# Altium schematic sheet 5V-3.3V Buck Converter.SchDoc: 5V - 3.3V Buck Converter
size Letter; DrawnBy: Cindy Li; Organization: Altium Limited; Address1: L3, 12a Rodborough Rd; Address2: Frenchs Forest; Address3: NSW; Address4: Australia 2086; DocumentNumber: 1; SheetNumber: 1; SheetTotal: 1
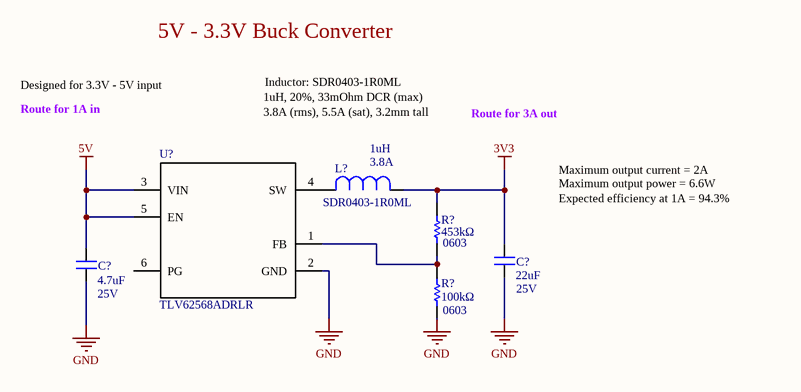
[diagram p0: 5V-3.3V Buck Converter.SchDoc]

## Parts
(Parts that share a designator on the sheet are numbered #1, #2 ... from top to bottom, then left to right.)
C?#1  value 4.7uF  Voltage Rating: 25V  [CAPC3225X280N]  (hidden comment: CAP_4.7uF_25V_1210)
C?#2  Voltage: 25V  Capacitance: 22uF  [CAPC3225X270N]  (hidden comment: GRM32ER71E226ME15K)
L?  value 1uH  Manufacturer Part Number 1: SDR0403-1R0ML  Current Rating: 3.8A  [IND_BOURNS_SDR04]  (hidden comment: IND_1uH_3.8A)
R?#1  value 453kΩ  Package: 0603  [RESC0603(1608)_N]  (hidden comment: RES_453kΩ_0603)
R?#2  value 100kΩ  Package: 0603  [RESC0603(1608)_N]  (hidden comment: RES_100kΩ_0603_1%)
U?  TLV62568ADRLR  [SOT50P160X60-6N]

## Nets
3V3: C?#2.2 L?.2 R?#1.2
5V: C?#1.2 U?.3(VIN) U?.5(EN)
GND: C?#1.1 C?#2.1 R?#2.1 U?.2(GND)
NetL?_1: L?.1 U?.4(SW)
NetR?#1_1: R?#1.1 R?#2.2 U?.1(FB)

Not connected (* = marked no-connect by the designer): U? 6(PG)

## Notes on the sheet
- Designed for 3.3V - 5V input
- 5V - 3.3V Buck Converter
- Inductor: SDR0403-1R0ML
- Route for 1A in
- 1uH, 20%, 33mOhm DCR (max)
- 3.8A (rms), 5.5A (sat), 3.2mm tall
- Route for 3A out
- Maximum output current = 2A
- Maximum output power = 6.6W
- Expected efficiency at 1A = 94.3%
- Title
- Size:
- Date:
- Letter
- Drawn By:
- Sheet
- of
- File:

## Library data of the parts
C?#1 = CAP_4.7uF_25V_1210: CAP CER 4.7UF 25V X8L 1210; Manufacturer Part Number 1: GCJ32EL81E475KA01L; Manufacturer 1: Murata Electronics; Tolerance: 10%; Supplier Part Number 1: 490-16465-1-ND; Supplier 1: Digi-Key; Mount: Surface Mount; Case/Package: 1210; Case Code (Metric): 3225; Case Code (Imperial): 1210; Min Operating Temperature: -55°C; Max Operating Temperature: 150°C; Capacitance: 4.7uF
C?#2 = GRM32ER71E226ME15K: CAP CER 22UF 25V X7R 1210; Manufacturer 1: Murata Electronics; Tolerance: ±20%; Manufacturer Part Number 1: GRM32ER71E226ME15K; Supplier 1: Digi-Key; Supplier Part Number 1: 490-14682-1-ND; Package: 1210 (3225 Metric)
L? = IND_1uH_3.8A: FIXED IND 1UH 3.8A 33 MOHM SMD; Manufacturer 1: Bourns Inc.; Tolerance: ±20%; Supplier Part Number 1: SDR0403-1R0MLCT-ND; Supplier 1: Digi-Key
R?#1 = RES_453kΩ_0603: RES SMD 453K OHM 1% 1/10W 0603; Manufacturer 1: Panasonic Electronic Components; Manufacturer Part Number 1: ERJ-3EKF4533V; Dimensions: 0.063" L x 0.031" W (1.60mm x 0.80mm); Supplier Part Number 1: P453KHCT-ND; Supplier 1: Digi-Key; Mount: Surface Mount; Case Code (Metric): 1608; Tolerance: 1%; Case/Package: 0603
R?#2 = RES_100kΩ_0603_1%: RES SMD 100K OHM 1% 1/10W 0603; Manufacturer 1: Yageo; Manufacturer Part Number 1: RC0603FR-07100KL; Dimensions: 0.063" L x 0.031" W (1.60mm x 0.80mm); Supplier Part Number 1: 311-100KHRCT-ND; Supplier 1: Digi-Key; Mount: Surface Mount; Case Code (Metric): 1608; Tolerance: 1%; Case/Package: 0603
U? = TLV62568ADRLR: IC REG BUCK ADJUSTABLE 2A SOT563; Manufacturer 1: Texas Instruments; Vin (Min): 2.5V; Vin (Max): 5.5V; Vout (Min/Fixed): 0.6V; Iout: 1A; Switching Frequency: 1.5MHz; Manufacturer Part Number 1: TLV62568ADRLR; Supplier 1: Digi-Key; Supplier Part Number 1: 296-50407-1-ND; Vout (Max): 5.5V; Package: SOT-563, SOT-666; Iout (Max): 2A